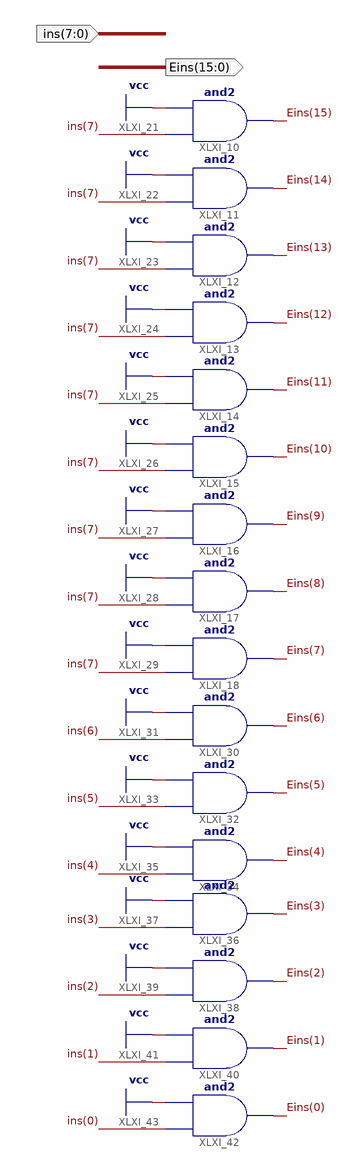
[diagram p0: schematic sheet 1]
// Xilinx ISE schematic sign_extender.sch (spartan6) as structural Verilog: 16 symbols, 2 ports
module sign_extender (
  input  [7:0] ins,
  output [15:0] Eins
);

  and XLXI_10 (Eins[15], 1'b1, ins[7]);
  and XLXI_11 (Eins[14], 1'b1, ins[7]);
  and XLXI_12 (Eins[13], 1'b1, ins[7]);
  and XLXI_13 (Eins[12], 1'b1, ins[7]);
  and XLXI_14 (Eins[11], 1'b1, ins[7]);
  and XLXI_15 (Eins[10], 1'b1, ins[7]);
  and XLXI_16 (Eins[9], 1'b1, ins[7]);
  and XLXI_17 (Eins[8], 1'b1, ins[7]);
  and XLXI_18 (Eins[7], 1'b1, ins[7]);
  and XLXI_30 (Eins[6], 1'b1, ins[6]);
  and XLXI_32 (Eins[5], 1'b1, ins[5]);
  and XLXI_34 (Eins[4], 1'b1, ins[4]);
  and XLXI_36 (Eins[3], 1'b1, ins[3]);
  and XLXI_38 (Eins[2], 1'b1, ins[2]);
  and XLXI_40 (Eins[1], 1'b1, ins[1]);
  and XLXI_42 (Eins[0], 1'b1, ins[0]);
endmodule
